# EAGLE design high side (EAGLE 9.6.2)
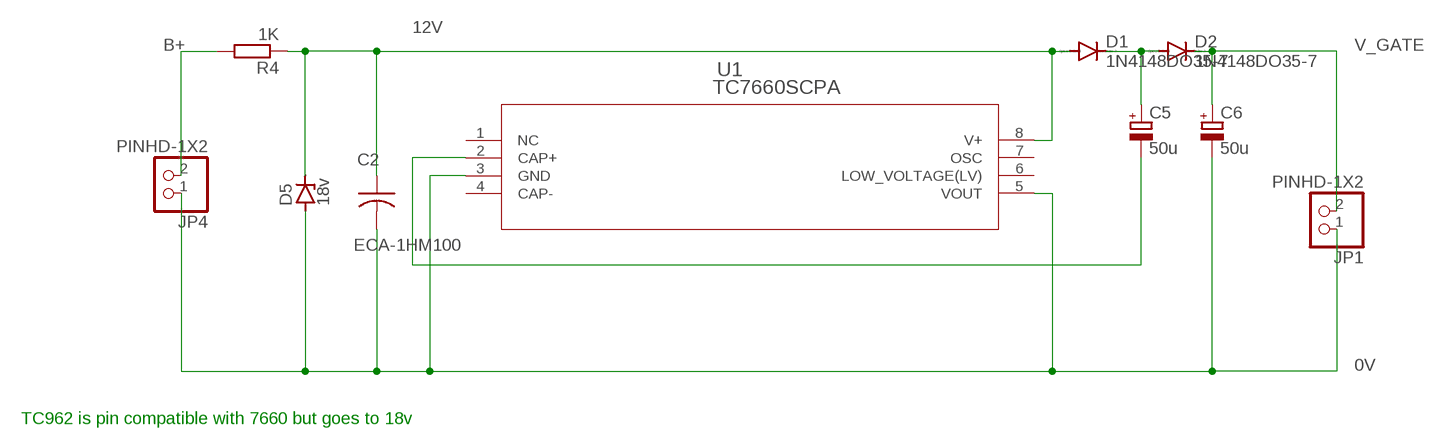
[diagram p0: schematic, sheet 1]

## Parts
C2  ECA-1HM100  [CAP_RADIAL_2MM]
C5  50u  C-POL_RADIAL-11MM-DIA  [CAPPRD508W65D1000H1100B]
C6  50u  C-POL_RADIAL-11MM-DIA  [CAPPRD508W65D1000H1100B]
D1  1N4148DO35-7  [DO35-7]
D2  1N4148DO35-7  [DO35-7]
D5  18v  ZENER-DIODEF126-10  [F126Z10]
JP1  PINHD-1X2  [1X02]
JP4  PINHD-1X2  [1X02]
R4  1K  R-EU_0204/7  [0204/7]
U1  TC7660SCPA  [PDIP8_300MC_MCH]

## Nets
0V: C2.2 C6.2(-) D5.A JP1.1 JP4.1 U1.3(GND) U1.5(VOUT)
12V: C2.1 D1.A D5.C R4.1 U1.8(V+)
B+: JP4.2 R4.2
N$16: C5.2(-) U1.2(CAP+)
N$18: C5.1(+) D1.C D2.A
V_GATE: C6.1(+) D2.C JP1.2
Unconnected: U1.1(NC) U1.4(CAP-) U1.6(LOW_VOLTAGE(LV)) U1.7(OSC)

## Notes on the sheet
- TC962 is pin compatible with 7660 but goes to 18v

## Library data of the parts
C2 = Resistor_Capacitor:ECA-1HM100: CAP ALUM 10UF 20% 50V RADIAL Manufacturer's datasheet <https://media.digikey.com/pdf/Data%20Sheets/Panasonic%20Electronic%20Components/ECA-xxM%20Series,TypeA.pdf>; CREATED_BY: PCBLayout.com; DIGIKEY_PART_NUMBER: P5178-ND; MANUFACTURER: Panasonic Electronic Components; MPN: ECA-1HM100; PACKAGE: CAP RADIAL 2MM LS
C5 C6 = Capacitor:C-POL: Capacitor Polarised - Generic; CATEGORY: Capacitor
D1 D2 = diode:1N4148: DIODE high speed (Philips)
D5 = diode:ZENER-DIODE: Z-Diode
JP1 JP4 = Connector:PINHD-1X2: PIN HEADER; CATEGORY: CONNECTOR; SUB-CATEGORY: PIN-HEADER
R4 = resistor:R-EU_: RESISTOR, European symbol
U1 = andrew-boyson:TC7660SCPA; COPYRIGHT: Copyright (C) 2021 Ultra Librarian. All rights reserved.; MANUFACTURER_PART_NUMBER: TC7660SCPA; MFR_NAME: Microchip

## Board
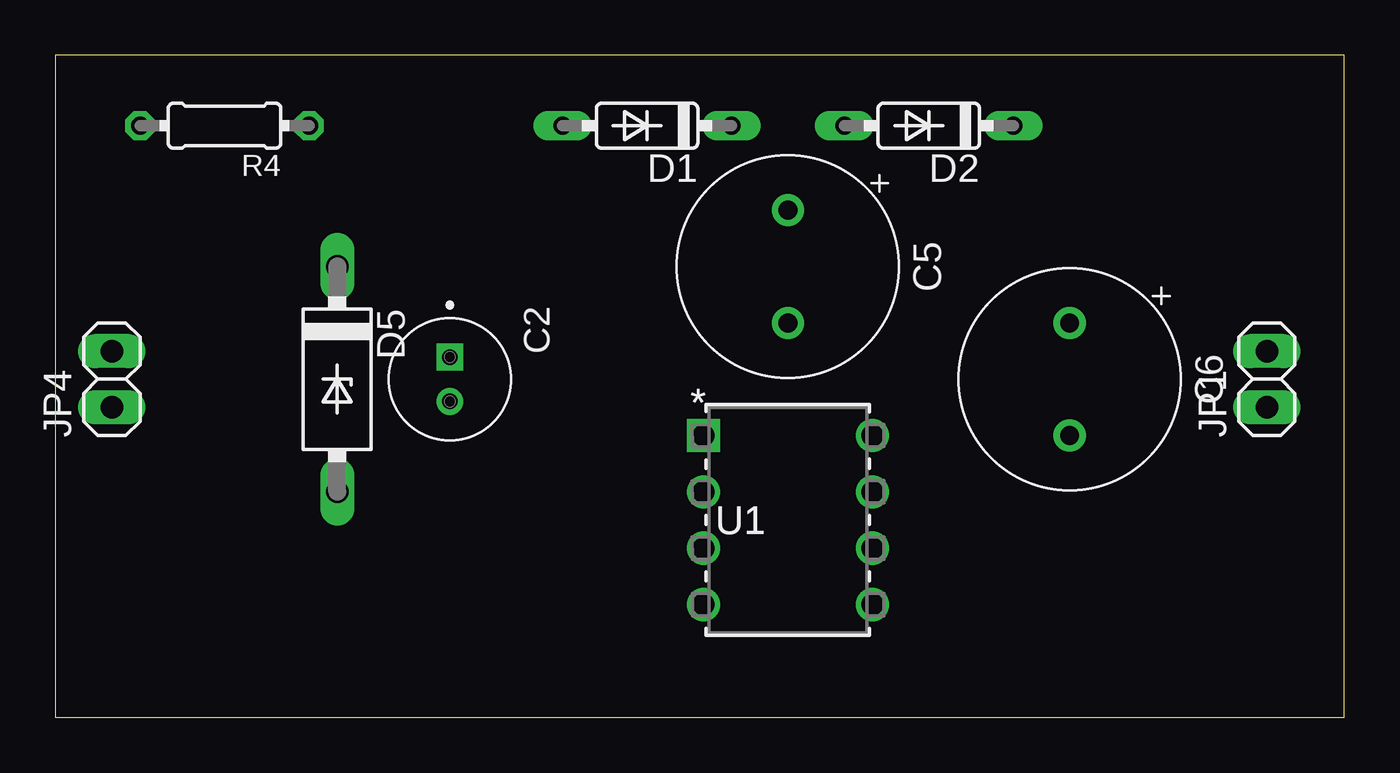
[diagram p1: board, top side]
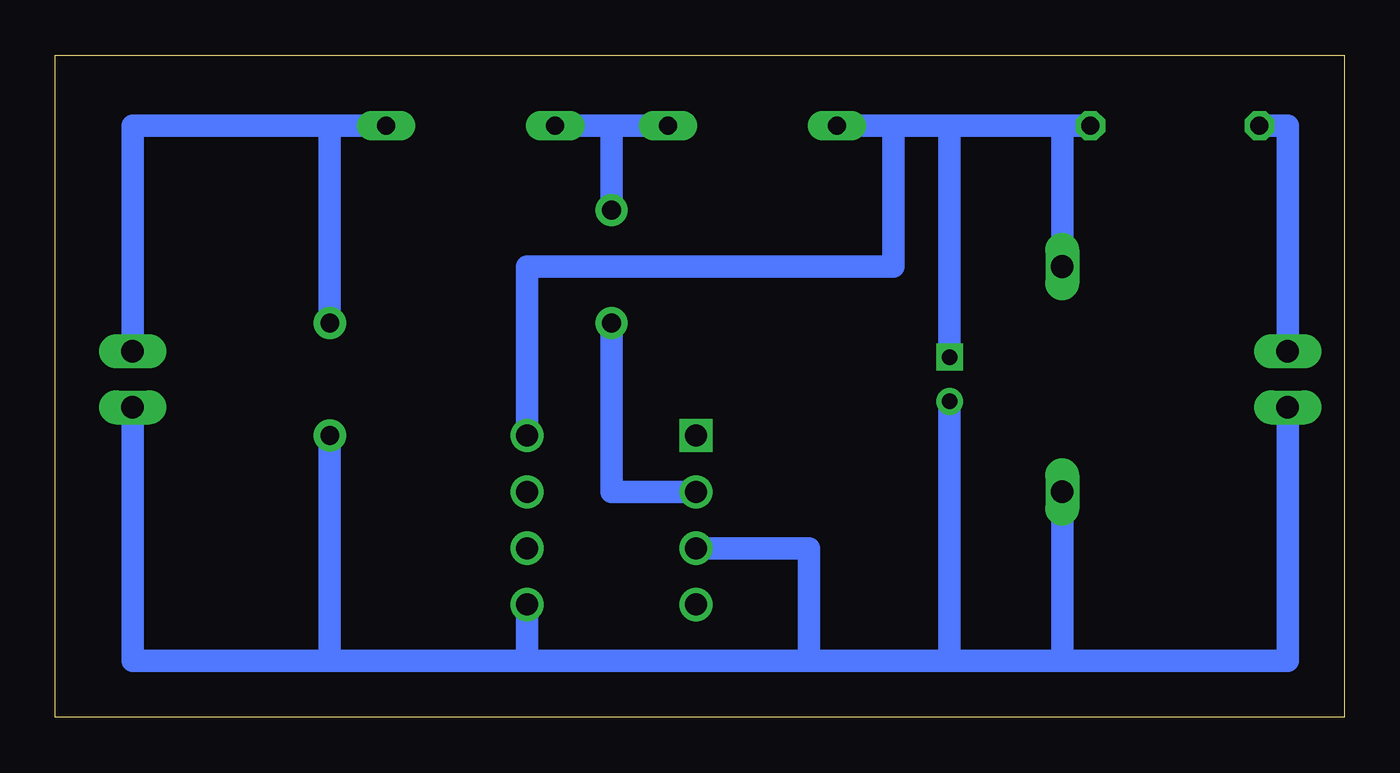
[diagram p2: board, bottom side, seen from below]

Size 58.09 x 29.84 mm. Coordinates in mm from the lower left corner, seen from the top.
Outline: 0,0 58.09,0 58.09,29.84 0,29.84 0,0
Copper layers (1*16): Top 0.035mm / dielectric 1.5mm / Bottom 0.035mm
Design rules "default": minimum track width 6mil, minimum drill 0.35mm, track to track 6mil, track to pad 6mil, pad to pad 6mil, via to via 6mil, smd to smd 6mil, copper to edge 40mil, drill to drill 6mil, minimum pad ring 10mil, minimum via ring 8mil, stop-mask expansion 4mil, vias tented up to drill 0mil, thermal gap 10mil

### Footprints (pad centres in the part's own frame; a part is rotated, then mirrored left to right if it is on the bottom)
CAP_RADIAL_2MM = drill 0.7 pad 1.1 square: 1 -1,0 | drill 0.7 pad 1.1: 2 1,0
CAPPRD508W65D1000H1100B = drill 0.85 pad 1.45: 1 -2.54,0; 2 2.54,0
DO35-7 = drill 0.813 long: A 3.81,0; C -3.81,0
F126Z10 = drill 1.016 long: A 5.08,0; C -5.08,0
1X02 = drill 1.016 long: 1 -1.27,0; 2 1.27,0
0204/7 = drill 0.813 octagon: 1 -3.81,0; 2 3.81,0
PDIP8_300MC_MCH = drill 0.991 pad 1.499 square: 1 0,0 | drill 0.991 pad 1.499: 2 0,-2.54; 3 0,-5.08; 4 0,-7.62; 5 7.62,-7.62; 6 7.62,-5.08; 7 7.62,-2.54; 8 7.62,0

### Placement (x,y rotation side)
C2  17.78,15.24 270 top
C5  33.02,20.32 270 top
C6  45.72,15.24 270 top
D1  26.67,26.67 180 top
D2  39.37,26.67 180 top
D5  12.7,15.24 270 top
JP1  54.61,15.24 90 top
JP4  2.54,15.24 90 top
R4  7.62,26.67 180 top
U1  29.21,12.7 0 top

### Tracks (layer width: path | path; a pad name or v marks a point on that pad's centre or on a via)
0V
  Bottom 1.016: JP4.1 2.54,2.54 12.7,2.54 | 12.7,2.54 17.78,2.54 | 17.78,2.54 24.13,2.54 | 24.13,2.54 36.83,2.54 | 36.83,2.54 45.72,2.54 | 45.72,2.54 54.61,2.54 JP1.1 | C6.2 45.72,2.54 | D5.A 12.7,2.54 | C2.2 17.78,2.54 | U1.3 24.13,7.62 24.13,2.54 | U1.5 36.83,2.54
12V
  Bottom 1.016: R4.1 12.7,26.67 | 12.7,26.67 17.78,26.67 | 17.78,26.67 20.32,26.67 | 20.32,26.67 D1.A | D5.C 12.7,26.67 | C2.1 17.78,26.67 | U1.8 36.83,20.32 20.32,20.32 20.32,26.67
B+
  Bottom 1.016: JP4.2 2.54,26.67 R4.2
N$16
  Bottom 1.016: U1.2 33.02,10.16 C5.2
N$18
  Bottom 1.016: D1.C 33.02,26.67 | 33.02,26.67 D2.A | C5.1 33.02,26.67
V_GATE
  Bottom 1.016: JP1.2 54.61,26.67 45.72,26.67 | 45.72,26.67 D2.C | C6.1 45.72,26.67